# Altium schematic sheet ESD_Protection.SchDoc
size A4
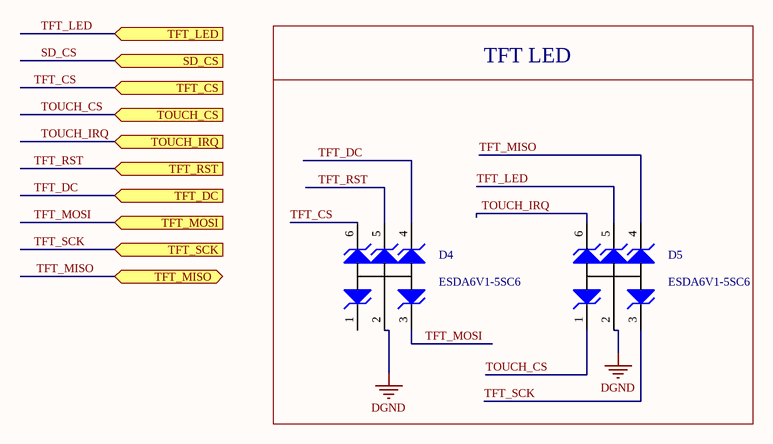
[diagram p0: ESD_Protection.SchDoc]

## Parts
D4  ESDA6V1-5SC6  [MF06A_N]
D5  ESDA6V1-5SC6  [MF06A_N]

## Blocks framed on the sheet
TFT LED: D4 D5

## Ports
SD_CS (in), TFT_CS (in), TFT_DC (in), TFT_LED (in), TFT_MISO, TFT_MOSI (in), TFT_RST (in), TFT_SCK (in), TOUCH_CS (in), TOUCH_IRQ (in)

## Nets
DGND: D4.2(K) D5.2(K)
SD_CS: port SD_CS
TFT_CS: D4.6(A) ; port TFT_CS
TFT_DC: D4.4(A) ; port TFT_DC
TFT_LED: D5.5(A) ; port TFT_LED
TFT_MISO: D5.4(A) ; port TFT_MISO
TFT_MOSI: D4.3(K) ; port TFT_MOSI
TFT_RST: D4.5(A) ; port TFT_RST
TFT_SCK: D5.3(K) ; port TFT_SCK
TOUCH_CS: D5.1(K) ; port TOUCH_CS
TOUCH_IRQ: D5.6(A) ; port TOUCH_IRQ

Not connected (* = marked no-connect by the designer): D4 1(K)

## Library data of the parts
D4 D5 = CMP-924f5b40f9684d88-1: ESDA Series 5 Channel 6.1 V 50 pF SMT Uni Directional Transil Array - SOT-23-6L; Operating Voltage: 6.10 V; Power Rating: 100 W; Breakdown Voltage: 7.20 V; Lead-Free Status: Lead Free; REACH SVHC Compliance: No SVHC; Number of Pins: 6; Case/Package: SOT-23; Size-Width: 1.75 mm; Mounting Style: Surface Mount; Manufacturer Part Number: ESDA6V1-5SC6; Size-Height: 1.45 mm; OctopartID: 924f5b40f9684d88; Size-Length: 3.05 mm; Packaging: Tape & Reel (TR), Cut Tape (CT); Octopart URL: http://octopart.com/esda6v1-5sc6-stmicroelectronics-347713; RoHS: Compliant; Voltage Rating (DC): 6.10 V; Lifecycle Status: Active; TME: ESDA6V1-5SC6